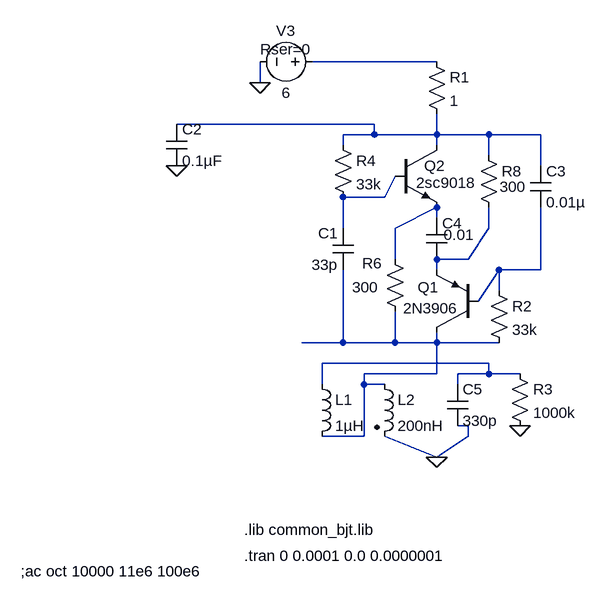
[diagram p0: schematic negtive-oscillator.asc]
negtive-oscillator.asc, the LTspice schematic file:
Version 4
SHEET 1 880 680
WIRE 304 -304 112 -304
WIRE 32 -272 32 -304
WIRE 208 -208 -96 -208
WIRE 208 -192 208 -208
WIRE 208 -192 160 -192
WIRE 304 -192 304 -224
WIRE 304 -192 208 -192
WIRE 384 -192 304 -192
WIRE 464 -192 384 -192
WIRE 160 -176 160 -192
WIRE 304 -176 304 -192
WIRE 384 -160 384 -192
WIRE 464 -144 464 -192
WIRE 224 -96 240 -128
WIRE 224 -96 160 -96
WIRE 304 -64 304 -80
WIRE 160 -48 160 -96
WIRE 240 -48 304 -80
WIRE 384 -48 384 -80
WIRE 240 0 240 -48
WIRE 352 0 384 -48
WIRE 352 0 304 0
WIRE 304 16 304 0
WIRE 464 16 464 -80
WIRE 464 16 400 16
WIRE 400 48 400 16
WIRE 368 64 400 16
WIRE 160 128 160 16
WIRE 160 128 96 128
WIRE 240 128 240 80
WIRE 240 128 160 128
WIRE 304 128 304 112
WIRE 304 128 240 128
WIRE 400 128 304 128
WIRE 384 160 128 160
WIRE 304 176 304 128
WIRE 304 176 192 176
WIRE 384 176 384 160
WIRE 384 176 336 176
WIRE 432 176 384 176
WIRE 128 192 128 160
WIRE 192 192 192 176
WIRE 224 192 192 192
WIRE 336 192 336 176
WIRE 352 256 336 256
WIRE 192 272 192 192
WIRE 192 272 128 272
WIRE 352 272 352 256
WIRE 304 304 224 272
WIRE 304 304 352 272
FLAG 32 -272 0
FLAG 432 256 0
FLAG -96 -144 0
FLAG 304 304 0
SYMBOL res 384 32 R0
SYMATTR InstName R2
SYMATTR Value 33k
SYMBOL cap 176 16 R180
WINDOW 0 24 56 Left 2
WINDOW 3 24 8 Left 2
SYMATTR InstName C1
SYMATTR Value 33p
SYMBOL npn 240 -176 R0
WINDOW 0 45 32 Left 2
WINDOW 3 32 58 Left 2
SYMATTR InstName Q2
SYMATTR Value 2sc9018
SYMBOL res 144 -192 R0
SYMATTR InstName R4
SYMATTR Value 33k
SYMBOL ind2 208 176 R0
SYMATTR InstName L2
SYMATTR Value 200nH
SYMATTR SpiceLine Ipk=3 Rser=0.0 Rpar=1e22 Cpar=0
SYMATTR Type ind
SYMBOL voltage 128 -304 M270
WINDOW 0 32 56 VTop 2
WINDOW 3 -32 56 VBottom 2
WINDOW 123 0 0 Left 2
WINDOW 39 4 56 VTop 2
SYMATTR InstName V3
SYMATTR Value 6
SYMATTR SpiceLine Rser=0
SYMBOL pnp 368 112 R180
WINDOW 0 61 69 Left 2
WINDOW 3 31 37 Left 2
SYMATTR InstName Q1
SYMATTR Value 2N3906
SYMBOL cap 320 192 R0
SYMATTR InstName C5
SYMATTR Value 330p
SYMBOL cap 448 -144 R0
SYMATTR InstName C3
SYMATTR Value 0.01µ
SYMBOL res 288 -320 R0
SYMATTR InstName R1
SYMATTR Value 1
SYMBOL res 416 160 R0
SYMATTR InstName R3
SYMATTR Value 1000k
SYMBOL cap -112 -208 R0
SYMATTR InstName C2
SYMATTR Value 0.1µF
SYMBOL cap 288 -64 R0
WINDOW 3 27 26 Left 2
SYMATTR Value 0.01
SYMATTR InstName C4
SYMBOL res 224 -16 R0
WINDOW 0 -35 22 Left 2
WINDOW 3 -50 59 Left 2
SYMATTR InstName R6
SYMATTR Value 300
SYMBOL res 368 -176 R0
WINDOW 3 33 64 Left 2
SYMATTR Value 300
SYMATTR InstName R8
SYMBOL ind 112 176 R0
SYMATTR InstName L1
SYMATTR Value 1µH
TEXT 8 416 Left 2 !.lib common_bjt.lib
TEXT 8 456 Left 2 !.tran 0 0.0001 0.0 0.0000001
TEXT -336 480 Left 2 !;ac oct 10000 11e6 100e6

The netlist it stands for:
* negtive-oscillator.asc
R2 N006 N007 33k
C1 N007 N003 33p
Q2 N002 N003 N004 0 2sc9018
R4 N002 N003 33k
L2 N007 0 200nH Ipk=3 Rser=0.0 Rpar=1e22 Cpar=0
V3 N001 0 6 Rser=0
Q1 N007 N006 N005 0 2N3906
C5 N008 0 330p
C3 N002 N006 0.01µ
R1 N001 N002 1
R3 N008 0 1000k
C2 N002 0 0.1µF
C4 N004 N005 0.01
R6 N004 N007 300
R8 N002 N005 300
L1 N008 N007 1µH
.model NPN NPN
.model PNP PNP
.lib standard.bjt
.lib common_bjt.lib
.tran 0 0.0001 0.0 0.0000001
;ac oct 10000 11e6 100e6
.backanno
.end